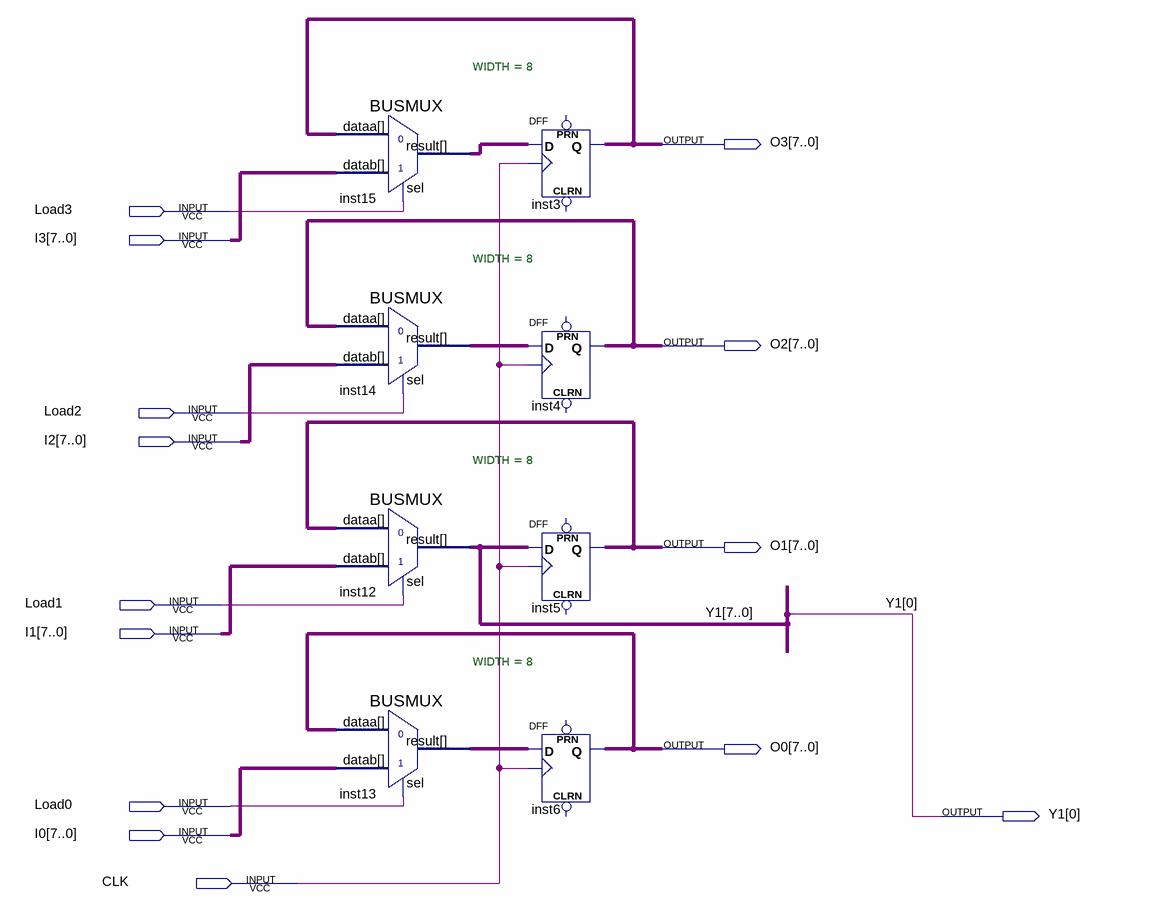
[diagram p0: schematic sheet]
// Quartus schematic REGISTER.bdf as structural Verilog: 8 symbols, 14 pins
module REGISTER (
  input  Load3,
  input  [7:0] I3,
  input  Load2,
  input  [7:0] I2,
  input  Load1,
  input  [7:0] I1,
  input  Load0,
  input  [7:0] I0,
  input  CLK,
  output [7:0] O3,
  output [7:0] O2,
  output [7:0] O1,
  output [7:0] O0,
  output [7:0] Y1
);

  wire [7:0] inst13_result, inst14_result, inst15_result;

  BUSMUX #(.WIDTH(8)) inst15 (.dataa(O3), .datab(I3), .sel(Load3), .result(inst15_result));
  BUSMUX #(.WIDTH(8)) inst14 (.dataa(O2), .datab(I2), .sel(Load2), .result(inst14_result));
  BUSMUX #(.WIDTH(8)) inst12 (.dataa(O1), .datab(I1), .sel(Load1), .result(Y1));
  BUSMUX #(.WIDTH(8)) inst13 (.dataa(O0), .datab(I0), .sel(Load0), .result(inst13_result));
  DFF inst3[7:0] (.CLK(CLK), .D(inst15_result), .Q(O3));  // open: CLRN, PRN
  DFF inst4[7:0] (.CLK(CLK), .D(inst14_result), .Q(O2));  // open: CLRN, PRN
  DFF inst5[7:0] (.CLK(CLK), .D(Y1), .Q(O1));  // open: CLRN, PRN
  DFF inst6[7:0] (.CLK(CLK), .D(inst13_result), .Q(O0));  // open: CLRN, PRN
endmodule
